# Altium schematic sheet MCLK_Oscillator.SchDoc: MCLK Oscillator
size A4; DocumentNumber: 6; SheetNumber: 6; SheetTotal: 8
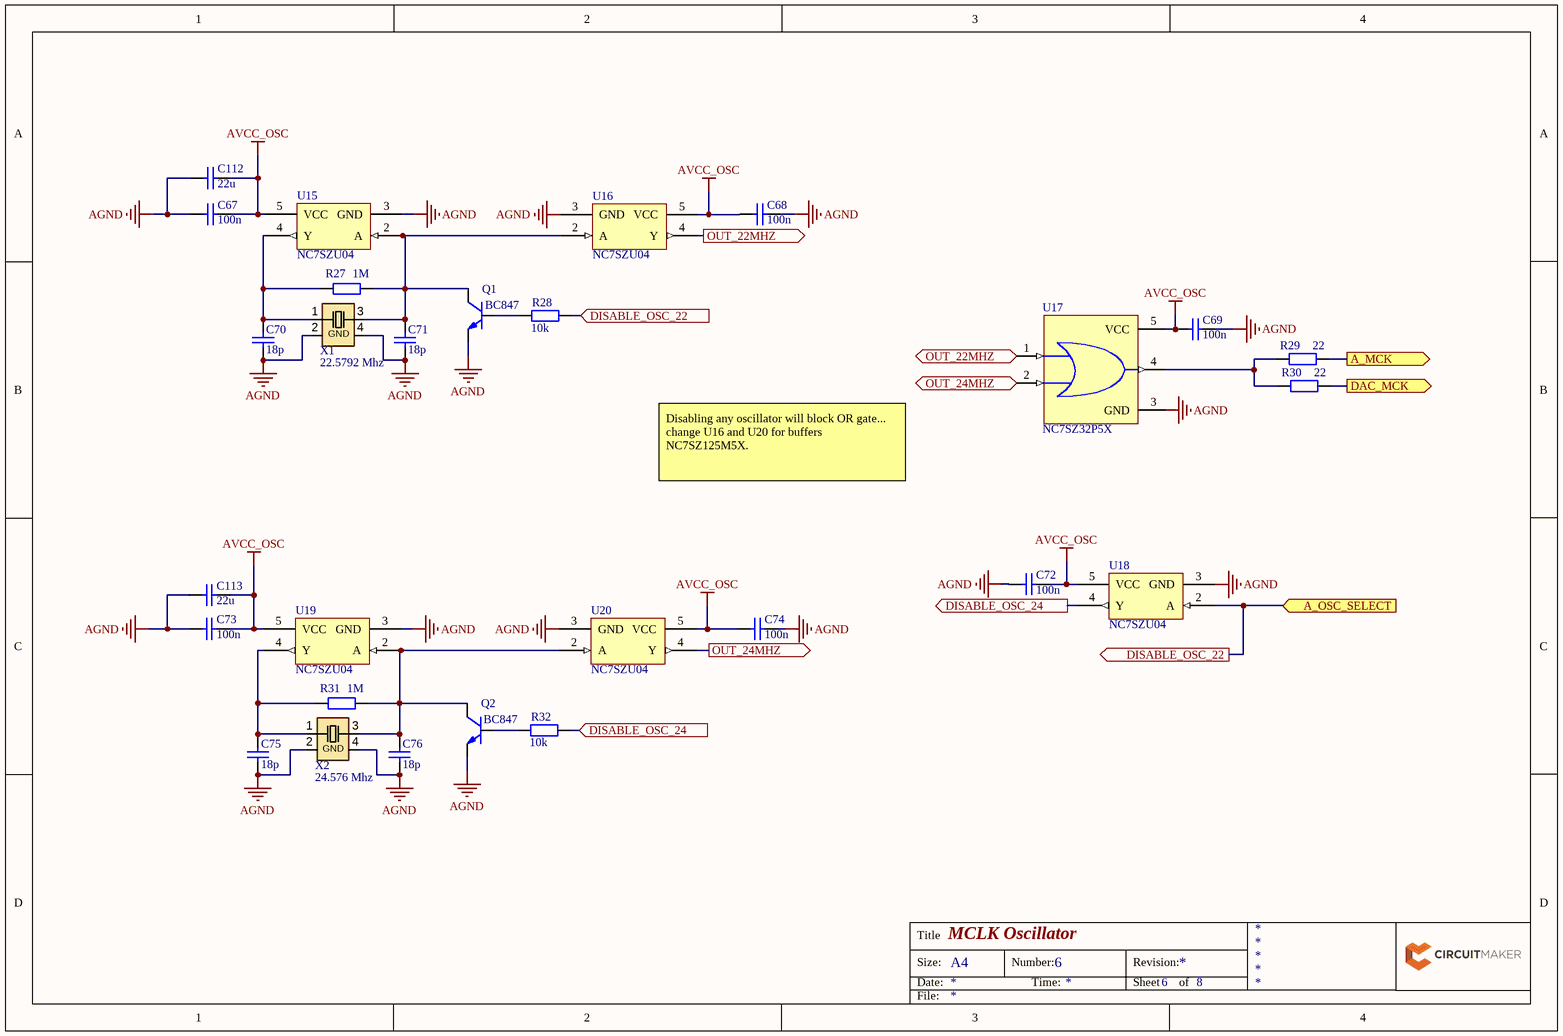
[diagram p0: MCLK_Oscillator.SchDoc]

## Parts
C67  100n  [PCB-rf0pzaa82dpbeu9l4sxm-1]
C68  100n  [PCB-rf0pzaa82dpbeu9l4sxm-1]
C69  100n  [PCB-rf0pzaa82dpbeu9l4sxm-1]
C70  18p  [PCB-rf0pzaa82dpbeu9l4sxm-1]
C71  18p  [PCB-rf0pzaa82dpbeu9l4sxm-1]
C72  100n  [PCB-rf0pzaa82dpbeu9l4sxm-1]
C73  100n  [PCB-rf0pzaa82dpbeu9l4sxm-1]
C74  100n  [PCB-rf0pzaa82dpbeu9l4sxm-1]
C75  18p  [PCB-rf0pzaa82dpbeu9l4sxm-1]
C76  18p  [PCB-rf0pzaa82dpbeu9l4sxm-1]
C112  22u  [PCB-rf0pzaa82dpbeu9l4sxm-1]
C113  22u  [PCB-rf0pzaa82dpbeu9l4sxm-1]
Q1  BC847  [SOT23-BEC]
Q2  BC847  [SOT23-BEC]
R27  1M  [PCB-3d5y3t7f8drf35yjcj59-1]
R28  10k  [PCB-3d5y3t7f8drf35yjcj59-1]
R29  22  [PCB-3d5y3t7f8drf35yjcj59-1]
R30  22  [PCB-3d5y3t7f8drf35yjcj59-1]
R31  1M  [PCB-3d5y3t7f8drf35yjcj59-1]
R32  10k  [PCB-3d5y3t7f8drf35yjcj59-1]
U15  NC7SZU04  [PCB-wxeqetr75037g92pbgyq-1]
U16  NC7SZU04  [PCB-wxeqetr75037g92pbgyq-1]
U17  NC7SZ32P5X  [PCB-eypsu81inaog57bsahf2-1]
U18  NC7SZU04  [PCB-wxeqetr75037g92pbgyq-1]
U19  NC7SZU04  [PCB-wxeqetr75037g92pbgyq-1]
U20  NC7SZU04  [PCB-wxeqetr75037g92pbgyq-1]
X1  22.5792 Mhz  [PCB-5cl8jn5un4pdqd8b4poj-1]
X2  24.576 Mhz  [PCB-5cl8jn5un4pdqd8b4poj-1]

## Ports
A_MCK (out), A_OSC_SELECT (in), DAC_MCK (out), DISABLE_OSC_22 (in), DISABLE_OSC_22 (out), DISABLE_OSC_24 (in), DISABLE_OSC_24 (out), OUT_22MHZ (in), OUT_22MHZ (out), OUT_24MHZ (in), OUT_24MHZ (out)

## Nets
AGND: C67.2 C68.1 C69.1 C70.2 C71.2 C72.2 C73.2 C74.1 C75.2 C76.2 C112.2 C113.2 Q1.E Q2.E U15.3(GND) U16.3(GND) U17.3(GND) U18.3(GND) U19.3(GND) U20.3(GND) X1.2(gnd) X1.4(gnd) X2.2(gnd) X2.4(gnd)
AVCC_OSC: C67.1 C68.2 C69.2 C72.1 C73.1 C74.2 C112.1 C113.1 U15.5(VCC) U16.5(VCC) U17.5(VCC) U18.5(VCC) U19.5(VCC) U20.5(VCC)
A_MCK: R29.1 ; port A_MCK
A_OSC_SELECT: R28.2 U18.2(A) ; port DISABLE_OSC_22, port A_OSC_SELECT
DAC_MCK: R30.1 ; port DAC_MCK
DISABLE_OSC_24: R32.2 U18.4(Y) ; port DISABLE_OSC_24
OUT_22MHZ: U16.4(Y) U17.1(A) ; port OUT_22MHZ
OUT_24MHZ: U17.2(B) U20.4(Y) ; port OUT_24MHZ
NetC70_1: C70.1 R27.1 U15.4(Y) X1.1
NetC71_1: C71.1 Q1.C R27.2 U15.2(A) U16.2(A) X1.3
NetC75_1: C75.1 R31.1 U19.4(Y) X2.1
NetC76_1: C76.1 Q2.C R31.2 U19.2(A) U20.2(A) X2.3
NetQ1_B: Q1.B R28.1
NetQ2_B: Q2.B R32.1
NetR29_2: R29.2 R30.2 U17.4(Y)

## Notes on the sheet
- Disabling any oscillator will block OR gate... change U16 and U20 for buffers NC7SZ125M5X.
- Title
- Size:
- Date:
- A4
- Number:
- Time:
- Revision:
- Sheet
- of
- File:
- (in symbol CMP-a7446b0f29ac7883-1) GND

## Library data of the parts
C67-C76 C112 C113 = CMP-x8hddryxw4o380xfi98v-3: Generic Capacitor 0603; CustomComponentID: x8hddryxw4o380xfi98v
  C67-C69 C72-C74: LCSC Part #: C14663; LCSC Part #: C109474; LCSC Part #: C19702
  C70 C71 C75 C76: LCSC Part #: C1679
  C112 C113: LCSC Part #: C59461
Q1 Q2 = CMP-856282-3: TRANS NPN 45V 0.1A SOT23; Manufacturer Part Number: BC847B,215; Lead-Free Status: Lead Free; OctopartID: a1e8687d65cd7e2f; Octopart Url: https://octopart.com/bc847b%2C215-nxp+semiconductors-10477891; Number of Pins: 3; REACH SVHC Compliance: No SVHC; Lifecycle Status: Active; Polarity: NPN; RoHS: Compliant; Mounting Style: Surface Mount
R27-R32 = CMP-xcu3s4ikiffkkgbeyow5-1: Resistor 0603; CustomComponentID: xcu3s4ikiffkkgbeyow5
  R27 R31: LCSC Part #: C22935
  R28 R32: LCSC Part #: C25804
  R29 R30: LCSC Part #: C23345
U15 U16 U18-U20 = CMP-4ef282fea2d39135-3: NC7SZU04 Series 5.5 V SMT Tinny Logic UHS Unbuffered Inverter - SOT-23-5; Manufacturer Part Number: NC7SZU04M5X; Number of Circuits: 1; Output Current: 16.0 mA; Supply Voltage (DC): 5.50 V (max), 1.65 V (min); Lead-Free Status: Lead Free; Operating Temperature: -40.0 °C (min); Number of Pins: 5; RoHS: Compliant; OctopartID: 4ef282fea2d39135; Octopart URL: https://octopart.com/nc7szu04m5x-on+semiconductor-84330823; Mounting Style: Surface Mount; REACH SVHC Compliance: No SVHC; Number of Gates: 1; Case/Package: SOT-23; Packaging: Cut Tape (CT); Lifecycle Status: Active
U17 = CMP-5a21962db65b85e6-2: NC7SZ32 Series 5.5 V Surface Mount TinyLogic®UHS 2-Input OR Gate - SC-70-5
X1 X2 = CMP-a7446b0f29ac7883-1: Crystal 18.432MHz ±20ppm (Tol) ±30ppm (Stability) 18pF FUND 80Ohm 4-Pin Mini-CSMD T/R